# EAGLE design MUX1 (EAGLE 9.5.1)
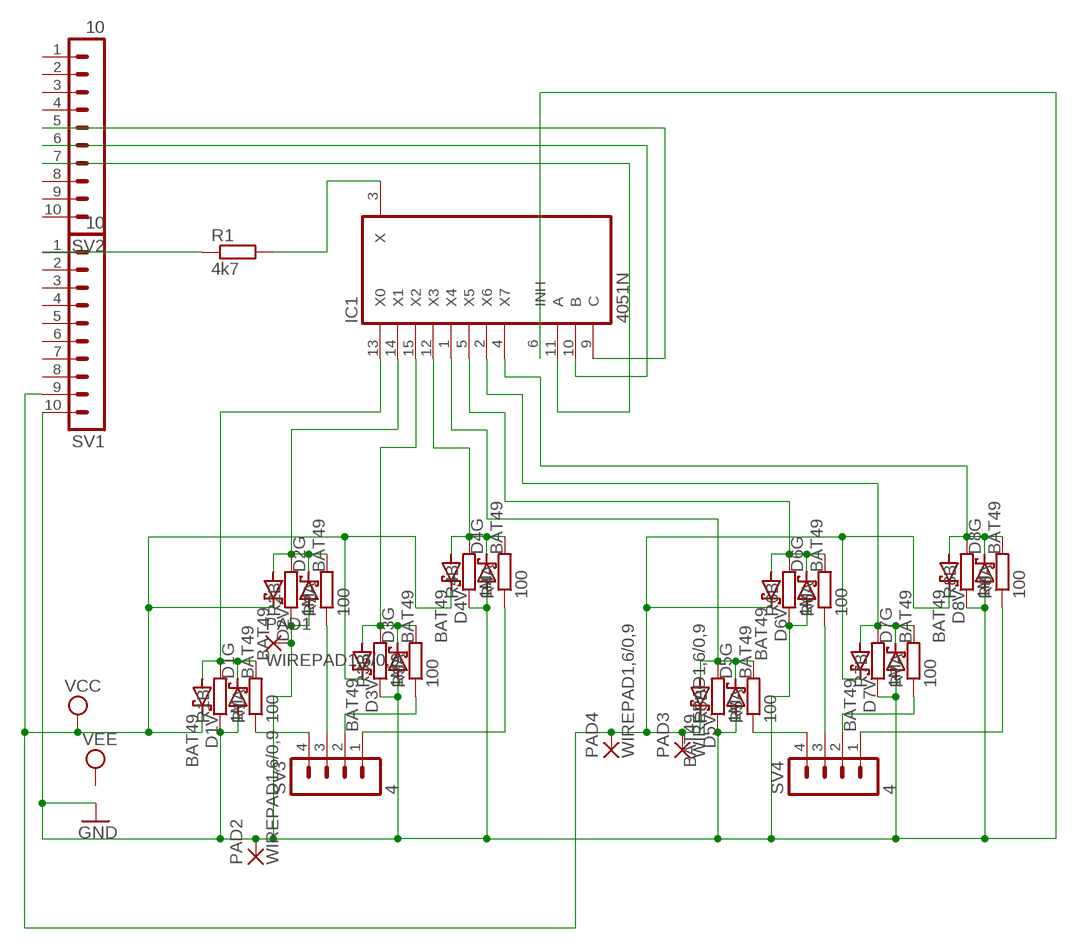
[diagram p0: schematic, sheet 1]

## Parts
D1G  BAT49  [DO41-10]
D1V  BAT49  [DO41-10]
D2G  BAT49  [DO41-10]
D2V  BAT49  [DO41-10]
D3G  BAT49  [DO41-10]
D3V  BAT49  [DO41-10]
D4G  BAT49  [DO41-10]
D4V  BAT49  [DO41-10]
D5G  BAT49  [DO41-10]
D5V  BAT49  [DO41-10]
D6G  BAT49  [DO41-10]
D6V  BAT49  [DO41-10]
D7G  BAT49  [DO41-10]
D7V  BAT49  [DO41-10]
D8G  BAT49  [DO41-10]
D8V  BAT49  [DO41-10]
IC1  4051N  [DIL16]
PAD1  WIREPAD1,6/0,9  [1,6/0,9]
PAD2  WIREPAD1,6/0,9  [1,6/0,9]
PAD3  WIREPAD1,6/0,9  [1,6/0,9]
PAD4  WIREPAD1,6/0,9  [1,6/0,9]
R1  4k7  R-EU_0204/7  [0204/7]
R1A  100  R-EU_0204/7  [0204/7]
R1B  1M  R-EU_0204/7  [0204/7]
R2A  100  R-EU_0204/7  [0204/7]
R2B  1M  R-EU_0204/7  [0204/7]
R3A  100  R-EU_0204/7  [0204/7]
R3B  1M  R-EU_0204/7  [0204/7]
R4A  100  R-EU_0204/7  [0204/7]
R4B  1M  R-EU_0204/7  [0204/7]
R5A  100  R-EU_0204/7  [0204/7]
R5B  1M  R-EU_0204/7  [0204/7]
R6A  100  R-EU_0204/7  [0204/7]
R6B  1M  R-EU_0204/7  [0204/7]
R7A  100  R-EU_0204/7  [0204/7]
R7B  1M  R-EU_0204/7  [0204/7]
R8A  100  R-EU_0204/7  [0204/7]
R8B  1M  R-EU_0204/7  [0204/7]
SV1  10  MA10-1  [MA10-1]
SV2  10  MA10-1  [MA10-1]
SV3  4  MA04-1  [MA04-1]
SV4  4  MA04-1  [MA04-1]

## Nets
GND: D1G.A D2G.A D3G.A D4G.A D5G.A D6G.A D7G.A D8G.A IC1.6(INH) PAD1.1(P) PAD2.1(P) R1B.1 R2B.1 R3B.1 R4B.1 R5B.1 R6B.1 R7B.1 R8B.1 SV1.10
N$1: R1A.1 SV3.4
N$2: R1.1 SV1.1
N$3: R2A.1 SV3.3
N$4: R3A.1 SV3.2
N$5: R5A.1 SV4.4
N$6: D2G.C D2V.A IC1.14(X1) R2A.2 R2B.2
N$7: D1G.C D1V.A IC1.13(X0) R1A.2 R1B.2
N$8: R4A.1 SV3.1
N$9: D5G.C D5V.A IC1.1(X4) R5A.2 R5B.2
N$10: IC1.9(C) SV2.5
N$11: D6G.C D6V.A IC1.5(X5) R6A.2 R6B.2
N$12: IC1.10(B) SV2.6
N$13: R6A.1 SV4.3
N$14: D8G.C D8V.A IC1.4(X7) R8A.2 R8B.2
N$15: R7A.1 SV4.2
N$16: R8A.1 SV4.1
N$17: D7G.C D7V.A IC1.2(X6) R7A.2 R7B.2
N$19: IC1.11(A) SV2.7
N$24: IC1.3(X) R1.2
N$26: D4G.C D4V.A IC1.12(X3) R4A.2 R4B.2
N$29: D3G.C D3V.A IC1.15(X2) R3A.2 R3B.2
VCC: D1V.C D2V.C D3V.C D4V.C D5V.C D6V.C D7V.C D8V.C PAD3.1(P) PAD4.1(P) SV1.9
Unconnected: SV1.2 SV1.3 SV1.4 SV1.5 SV1.6 SV1.7 SV1.8 SV2.1 SV2.2 SV2.3 SV2.4 SV2.8 SV2.9 SV2.10

## Power pins joined to a net without a drawn wire
GND: IC1.8(GND)
VCC: IC1.16(VCC)
VEE: IC1.7(VEE)

## Library data of the parts
D1G D1V D2G D2V D3G D3V D4G D4V D5G D5V D6G D6V D7G D7V D8G D8V = diode:BAT49: DIODE small signal diode
IC1 = 40xx:4051: 8-channel ANALOG MULTIPLEXER
PAD1-PAD4 = wirepad:WIREPAD: Wire PAD connect wire on PCB
R1 R1A R1B R2A R2B R3A R3B R4A R4B R5A R5B R6A R6B R7A R7B R8A R8B = rcl:R-EU_: RESISTOR, European symbol; SPICEPREFIX: R
SV1 SV2 = con-lstb:MA10-1: PIN HEADER; OC_FARNELL: unknown; OC_NEWARK: unknown
SV3 SV4 = con-lstb:MA04-1: PIN HEADER; OC_FARNELL: unknown; OC_NEWARK: unknown

## Board
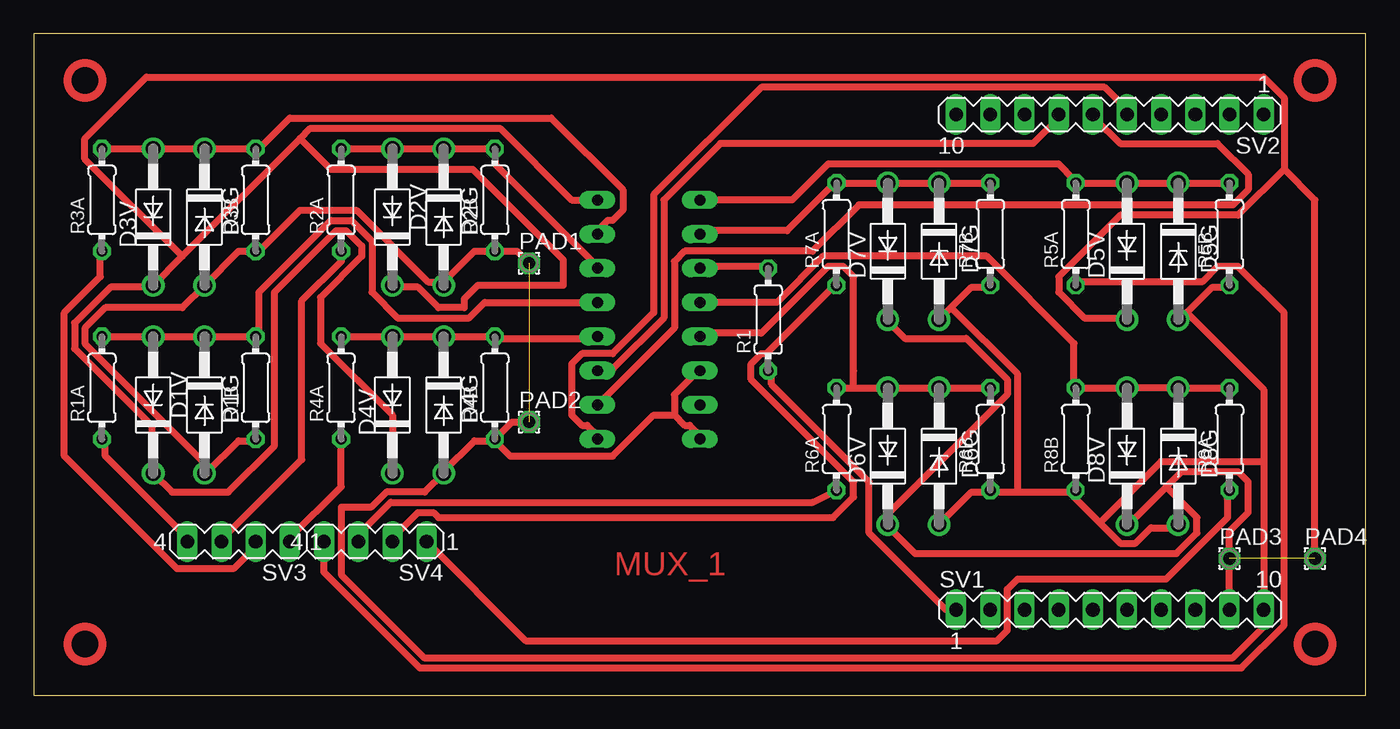
[diagram p1: board, top side]
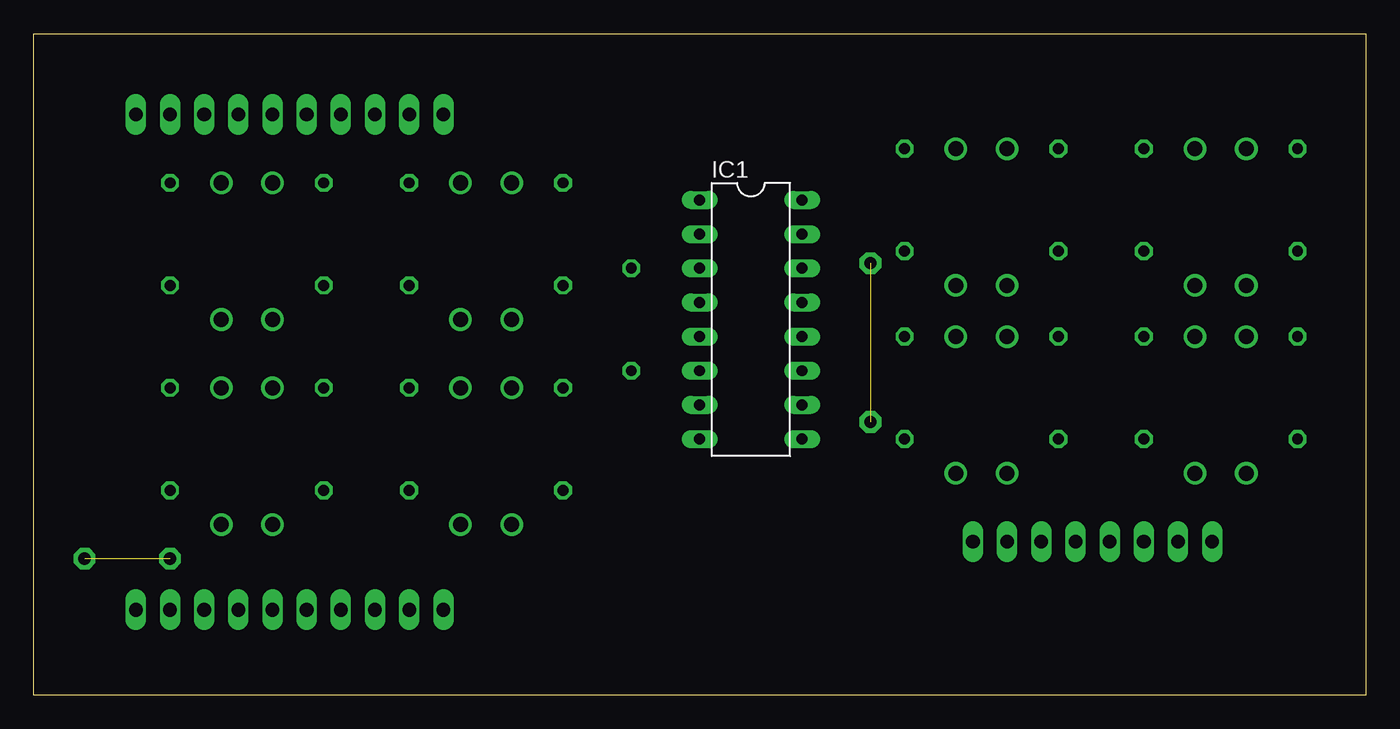
[diagram p2: board, bottom side, seen from below]

Size 99.04 x 49.2 mm. Coordinates in mm from the lower left corner, seen from the top.
Outline: 0,0 99.04,0 99.04,49.2 0,49.2 0,0
Copper layers (1*16): Top 0.035mm / dielectric 1.5mm / Bottom 0.035mm
Design rules "default *": minimum track width 20mil, minimum drill 0.5mm, track to track 10mil, track to pad 10mil, pad to pad 10mil, via to via 10mil, smd to smd 10mil, copper to edge 40mil, drill to drill 6mil, minimum pad ring 10mil, minimum via ring 8mil, stop-mask expansion 4mil, vias tented up to drill 0mil, thermal gap 10mil

### Footprints (pad centres in the part's own frame; a part is rotated, then mirrored left to right if it is on the bottom)
DO41-10 = drill 1.118: A 5.08,0; C -5.08,0
DIL16 = drill 0.813 long: 1 -8.89,-3.81; 2 -6.35,-3.81; 3 -3.81,-3.81; 4 -1.27,-3.81; 5 1.27,-3.81; 6 3.81,-3.81; 7 6.35,-3.81; 8 8.89,-3.81; 9 8.89,3.81; 10 6.35,3.81; 11 3.81,3.81; 12 1.27,3.81; 13 -1.27,3.81; 14 -3.81,3.81; 15 -6.35,3.81; 16 -8.89,3.81
1,6/0,9 = drill 0.914 pad 1.6 octagon: 1 0,0
0204/7 = drill 0.813 octagon: 1 -3.81,0; 2 3.81,0
MA10-1 = drill 1.016 long: 1 -11.43,0; 2 -8.89,0; 3 -6.35,0; 4 -3.81,0; 5 -1.27,0; 6 1.27,0; 7 3.81,0; 8 6.35,0; 9 8.89,0; 10 11.43,0
MA04-1 = drill 1.016 long: 1 -3.81,0; 2 -1.27,0; 3 1.27,0; 4 3.81,0

### Placement (x,y rotation side)
D1G  12.7,21.59 270 top
D1V  8.89,21.59 90 top
D2G  30.48,35.56 270 top
D2V  26.67,35.56 90 top
D3G  12.7,35.56 270 top
D3V  8.89,35.56 90 top
D4G  30.48,21.59 270 top
D4V  26.67,21.59 90 top
D5G  85.09,33.02 270 top
D5V  81.28,33.02 90 top
D6G  67.31,17.78 270 top
D6V  63.5,17.78 90 top
D7G  67.31,33.02 270 top
D7V  63.5,33.02 90 top
D8G  85.09,17.78 270 top
D8V  81.28,17.78 90 top
IC1  45.72,27.94 270 bottom
PAD1  36.83,32.13 0 top
PAD2  36.83,20.32 0 top
PAD3  88.9,10.16 0 top
PAD4  95.25,10.16 0 top
R1  54.61,27.94 90 top
R1A  5.08,22.86 90 top
R1B  16.51,22.86 90 top
R2A  22.86,36.83 90 top
R2B  34.29,36.83 90 top
R3A  5.08,36.83 90 top
R3B  16.51,36.83 90 top
R4A  22.86,22.86 90 top
R4B  34.29,22.86 90 top
R5A  77.47,34.29 90 top
R5B  88.9,34.29 90 top
R6A  59.69,19.05 90 top
R6B  71.12,19.05 90 top
R7A  59.69,34.29 90 top
R7B  71.12,34.29 90 top
R8A  88.9,19.05 90 top
R8B  77.47,19.05 90 top
SV1  80.01,6.35 0 top
SV2  80.01,43.18 180 top
SV3  15.24,11.43 180 top
SV4  25.4,11.43 180 top

### Tracks (layer width: path | path; a pad name or v marks a point on that pad's centre or on a via)
GND  (1 unrouted)
  Top 0.508: 85.72,28.45 85.34,28.07 D5G.A 85.72,28.45 | 85.72,28.45 87.63,30.35 88.77,30.35 R5B.1 | 91.44,17.4 91.44,22.73 85.72,28.45 | 91.44,17.4 SV1.10 91.44,5.08 89.15,2.79 29.02,2.79 22.86,8.95 22.86,13.97 25.08,13.97 26.23,15.11 29.08,15.11 D4G.A 30.48,16.64 32.77,18.92 34.29,18.92 | D7G.A 68.2,28.83 | 68.2,28.83 69.72,30.35 70.87,30.35 R7B.1 | D6G.A 69.72,15.11 70.87,15.11 R6B.1 71.25,15.11 73.15,15.11 | 73.15,15.11 76.96,15.11 | 76.96,15.11 77.34,15.11 R8B.1 76.96,15.11 | 76.96,15.11 79.25,12.83 | 79.25,12.83 80.77,11.3 81.92,11.3 83.06,12.45 84.96,12.45 D8G.A | 68.2,28.83 73.15,23.88 73.15,15.11 | 91.44,17.4 83.82,17.4 79.25,12.83 | 30.48,30.73 32.77,33.02 R2B.1 35.94,33.02 PAD1.1 | R1B.1 16.38,18.92 15.24,18.92 12.95,16.64 D1G.A 12.57,16.64 12.57,17.4 3.81,26.16 3.81,27.3 5.33,28.83 11.05,28.83 D3G.A 15.24,33.02 R3B.1 16.76,33.02 19.81,36.07 24,36.07 29.34,30.73 30.48,30.73 | 30.48,30.73 D2G.A | 47.62,20.83 48.39,20.07 48.77,20.07 49.53,19.3 IC1.8 | 47.62,20.83 47.62,22.35 49.53,24.26 IC1.6 | 47.62,20.83 46.1,20.83 43.05,17.78 35.43,17.78 34.29,18.92 | 34.29,18.92 R4B.1 35.56,20.32 PAD2.1
N$1
  Top 0.508: R1A.1 5.33,18.92 5.33,17.78 11.43,11.68 SV3.4
N$2
  Top 0.508: SV1.1 67.82,6.35 62.1,12.07 62.1,15.88 54.86,23.11 54.86,23.88 R1.1
N$3
  Top 0.508: R2A.1 22.86,32.26 19.94,29.34 19.94,17.53 14.1,11.68 SV3.3
N$4
  Top 0.508: R3A.1 4.95,33.02 4.95,31.12 2.29,28.45 2.29,17.78 10.67,9.4 14.86,9.4 16.76,11.3 SV3.2
N$5
  Top 0.508: R5A.1 77.72,30.73 86.87,30.73 88.01,31.88 89.53,31.88 92.96,28.45 92.96,5.21 89.79,2.03 28.7,2.03 21.59,9.14 SV4.4
N$6
  Top 0.508: R2A.2 D2V.A D2G.C R2B.2 34.29,39.5 41.91,31.88 IC1.14
N$7
  Top 0.508: R1A.2 D1V.A D1G.C R1B.2 16.76,26.92 16.76,29.97 22.1,35.31 23.62,35.31 25.15,33.78 25.15,29.97 27.05,28.07 32.38,28.07 33.53,29.21 IC1.13
N$8
  Top 0.508: R4A.1 22.86,15.49 19.05,11.68 SV3.1
N$9
  Top 0.508: R5B.2 D5G.C D5V.A R5A.2 77.34,38.35 76.2,39.5 59.05,39.5 56.39,36.83 IC1.1
N$10
  Top 0.508: IC1.9 41.91,19.3 41.15,20.07 40.77,20.07 40.01,20.83 40.01,24.64 40.77,25.4 43.05,25.4 46.1,28.45 46.1,37.21 54.1,45.21 79.63,45.21 81.53,43.31 SV2.5
N$11
  Top 0.508: R6A.2 60.96,22.86 | 60.96,22.86 D6V.A D6G.C | D6G.C 67.44,22.86 | 67.44,22.86 R6B.2 | 60.96,22.86 60.96,24.13 | 60.96,24.13 60.96,31.12 60.2,31.88 59.05,31.88 54.1,26.92 49.53,26.92 IC1.5 | D6G.C 67.44,22.73 67.44,22.86 | 60.96,24.13
N$12
  Top 0.508: IC1.10 47.62,27.3 47.62,32.26 48.39,33.02 57.91,33.02 61.34,36.45 89.15,36.45 90.3,37.59 90.3,38.74 88.01,41.02 80.77,41.02 78.87,42.93 SV2.6
N$13
  Top 0.508: R6A.1 57.91,14.35 26.54,14.35 23.96,11.77 SV4.3
N$14
  Top 0.508: R8A.2 D8G.C D8V.A R8B.2 77.34,23.11 77.34,26.16 70.87,32.64 58.67,32.64 55.24,29.21 IC1.4
N$15
  Top 0.508: R7A.1 59.44,30.35 54.48,25.4 54.1,25.4 53.34,24.64 53.34,23.5 60.96,15.88 60.96,14.73 59.44,13.21 30.1,13.21 29.72,13.59 28.57,13.59 26.67,11.68 SV4.2
N$16
  Top 0.508: SV4.1 36.58,4.06 71.63,4.06 72.39,4.83 72.39,7.87 73.15,8.64 84.2,8.64 88.77,13.21 88.77,15.11 R8A.1
N$17
  Top 0.508: R7B.2 D7G.C D7V.A R7A.2 59.44,37.97 56.01,34.54 49.53,34.54 IC1.2
N$19
  Top 0.508: IC1.11 41.91,24.26 43.05,24.26 46.86,28.07 46.86,36.83 51.05,41.02 74.3,41.02 76.2,42.93 SV2.7
N$24
  Top 0.508: IC1.3 49.53,31.88 54.48,31.88 R1.2
N$26
  Top 0.508: R4A.2 D4V.A D4G.C R4B.2 34.29,26.54 41.91,26.54 IC1.12
N$29
  Top 0.508: R3A.2 D3V.A D3G.C R3B.2 16.76,40.64 19.05,42.93 38.48,42.93 43.81,37.59 43.81,36.07 43.05,35.31 42.67,35.31 41.91,34.54 IC1.15
VCC  (1 unrouted)
  Top 0.508: 84.2,15.49 81.53,12.83 D8V.C | 84.2,15.49 85.34,16.64 89.53,16.64 90.3,15.88 90.3,13.59 88.9,12.19 PAD3.1 SV1.9 | D7V.C 63.63,27.69 64.77,26.54 69.34,26.54 72.39,23.5 72.39,22.35 63.63,13.59 63.63,12.83 D6V.C 63.63,12.45 65.53,10.54 84.96,10.54 86.49,12.07 86.49,13.21 84.2,15.49 | IC1.16 40.01,36.83 34.67,42.16 20.57,42.16 19.81,41.4 | 11.05,32.64 D3V.C 8.76,30.35 5.71,30.35 3.05,27.69 3.05,25.78 8.76,20.07 8.76,16.64 D1V.C 10.29,15.11 14.48,15.11 17.91,18.54 17.91,29.97 22.48,34.54 23.24,34.54 24.38,33.4 24.38,32.64 21.34,29.59 21.34,26.16 26.67,20.83 D4V.C | 11.05,32.64 19.81,41.4 | 19.81,41.4 22.1,39.12 32.64,39.12 39.37,32.38 39.37,30.48 33.02,30.48 32,29.46 32,28.83 30.1,28.83 28.57,30.35 26.67,30.35 D2V.C | 92.96,39.12 89.53,35.69 80.77,35.69 76.2,31.12 76.2,29.97 78.11,28.07 81.15,28.07 D5V.C | 92.96,39.12 92.96,44.45 91.44,45.97 8.38,45.97 3.81,41.4 3.81,39.88 11.05,32.64 | PAD4.1 95.25,36.83 92.96,39.12
(copper drawn outside any net)
  shapes: Top circle x4

### Text on the board
Top: MUX_1